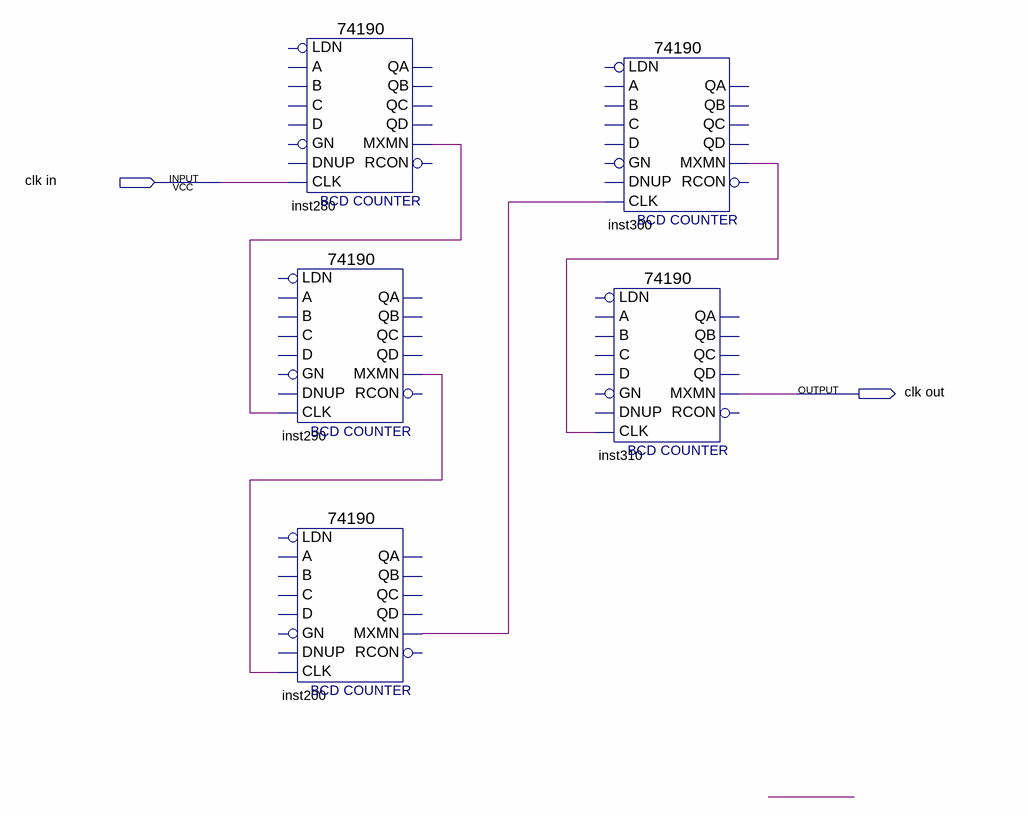
[diagram p0: schematic sheet]
// Quartus schematic diminuidor de clk.bdf as structural Verilog: 5 symbols, 2 pins
module \diminuidor_de_clk  (
  input  \clk_in ,
  output \clk_out 
);

  wire inst200_mxmn, inst280_mxmn, inst290_mxmn, inst300_mxmn;

  \74190  inst280 (.CLK(\clk_in ), .MXMN(inst280_mxmn));  // open: LDN, A, C, B, D, GN, DNUP, QA, QB, QD, QC, RCON
  \74190  inst290 (.CLK(inst280_mxmn), .MXMN(inst290_mxmn));  // open: LDN, A, C, B, D, GN, DNUP, QA, QB, QD, QC, RCON
  \74190  inst200 (.CLK(inst290_mxmn), .MXMN(inst200_mxmn));  // open: LDN, A, C, B, D, GN, DNUP, QA, QB, QD, QC, RCON
  \74190  inst300 (.CLK(inst200_mxmn), .MXMN(inst300_mxmn));  // open: LDN, A, C, B, D, GN, DNUP, QA, QB, QD, QC, RCON
  \74190  inst310 (.CLK(inst300_mxmn), .MXMN(\clk_out ));  // open: LDN, A, C, B, D, GN, DNUP, QA, QB, QD, QC, RCON
endmodule
